# EAGLE design antenna_test_1 (EAGLE 6.5.0)
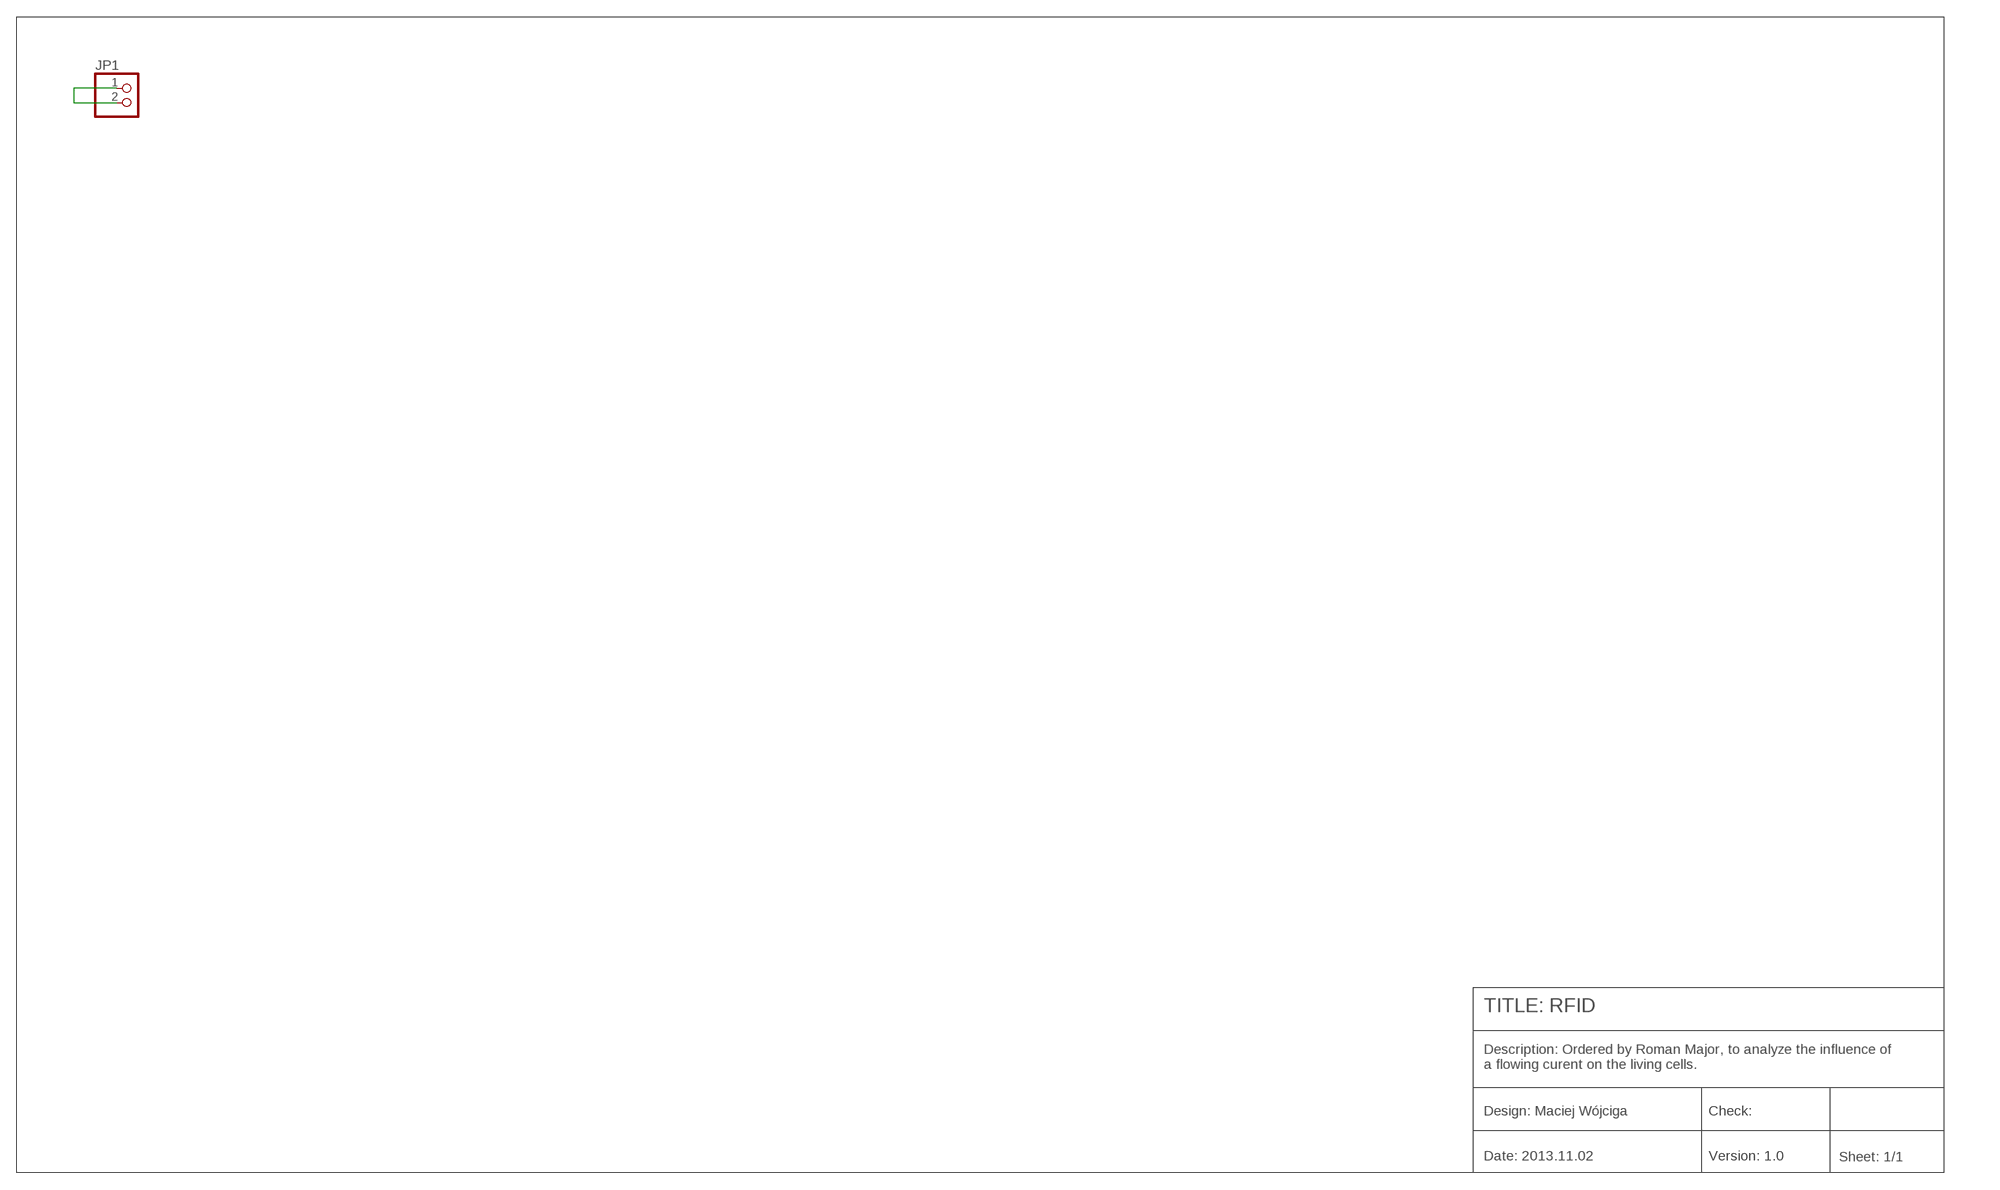
[diagram p0: schematic, sheet 1]

## Parts
JP1  PINHD-1X2  [1X02]

## Nets
N$1: JP1.1 JP1.2

## Notes on the sheet
- TITLE: RFID
- Description: Ordered by Roman Major, to analyze the influence of
  a flowing curent on the living cells.
- Design: Maciej Wójciga | Check:
- Date: 2013.11.02 | Version: 1.0 | Sheet: 1/1

## Library data of the parts
JP1 = pinhead:PINHD-1X2: PIN HEADER

## Board
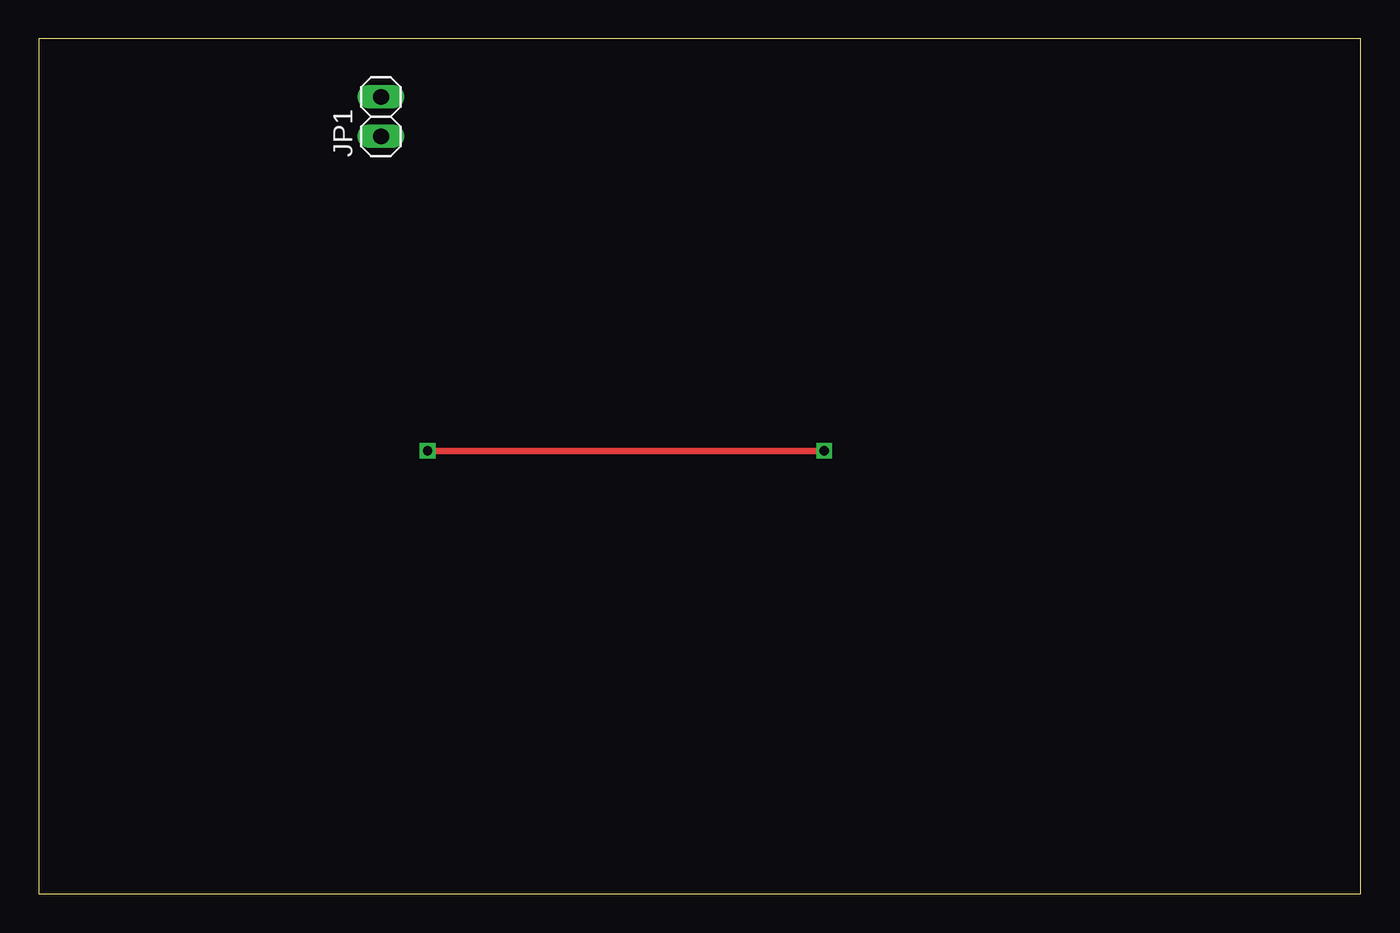
[diagram p1: board, top side]
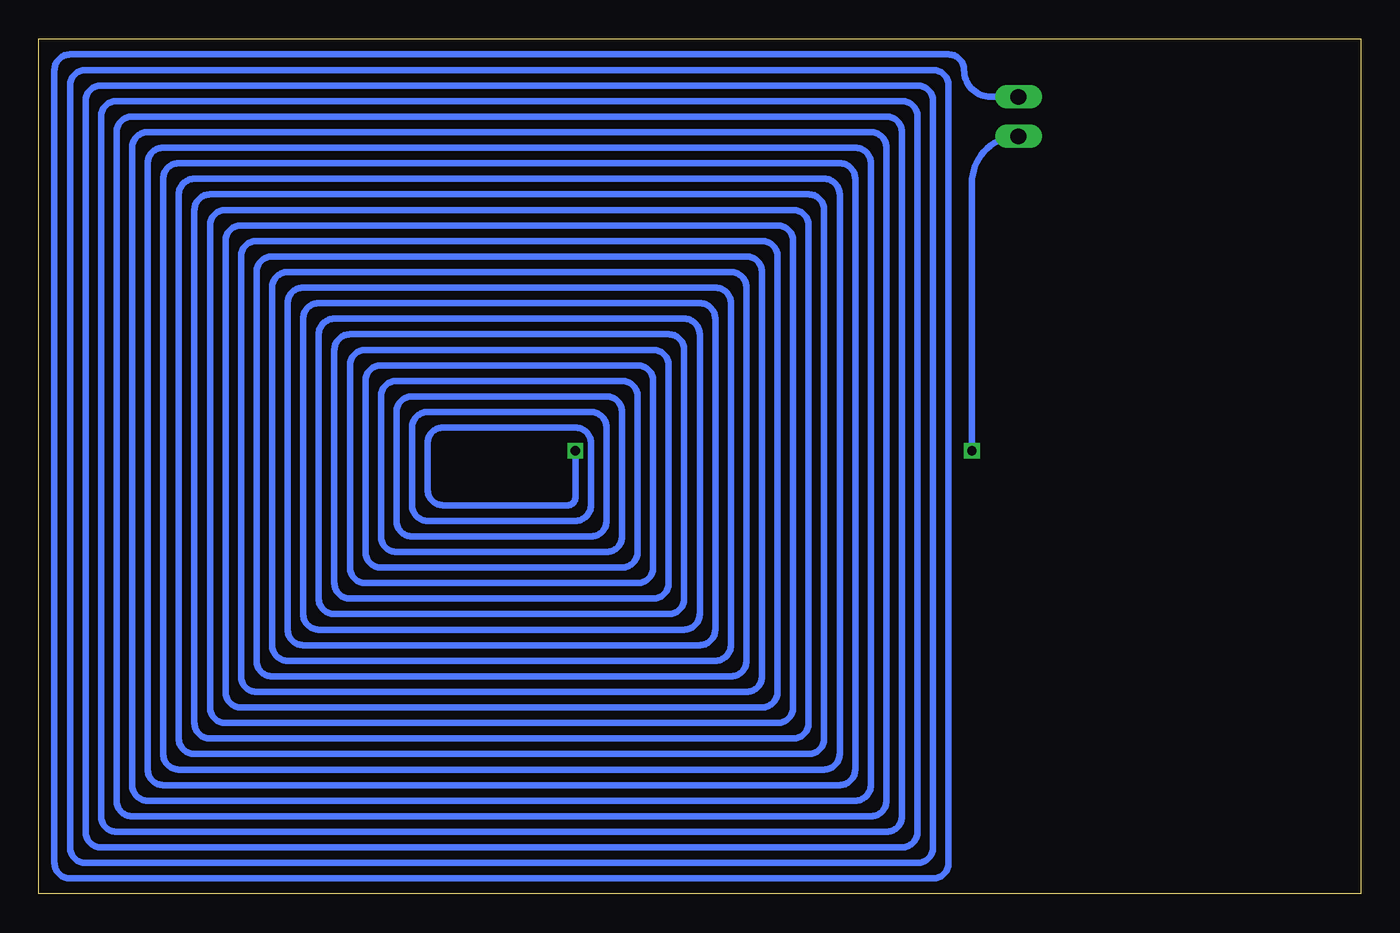
[diagram p2: board, bottom side, seen from below]

Size 85 x 55 mm. Coordinates in mm from the lower left corner, seen from the top.
Outline: 0,0 85,0 85,55 0,55 0,0
Copper layers (1*16): Top 0.035mm / dielectric 1.5mm / Bottom 0.035mm
Design rules "default": minimum track width 10mil, minimum drill 24mil, track to track 8mil, track to pad 8mil, pad to pad 8mil, via to via 8mil, smd to smd 8mil, copper to edge 40mil, drill to drill 8mil, minimum pad ring 10mil, minimum via ring 8mil, stop-mask expansion 4mil, vias tented up to drill 0mil, thermal gap 10mil

### Footprints (pad centres in the part's own frame; a part is rotated, then mirrored left to right if it is on the bottom)
1X02 = drill 1.016 long: 1 -1.27,0; 2 1.27,0

### Placement (x,y rotation side)
JP1  22,50 90 top

### Tracks (layer width: path | path; a pad name or v marks a point on that pad's centre or on a via)
N$1  (via drill 0.6)
  Top 0.406: v50.5,28.5 v25,28.5
  Bottom 0.406: JP1.2 23.77,51.27 arc90 25.5,53 arc-90 26.5,54 83,54 arc-90 84,53 84,2 arc-90 83,1 27.5,1 arc-90 26.5,2 26.5,52 arc-90 27.5,53 82,53 arc-90 83,52 83,3 arc-90 82,2 28.5,2 arc-90 27.5,3 27.5,51 arc-90 28.5,52 81,52 arc-90 82,51 82,4 arc-90 81,3 29.5,3 arc-90 28.5,4 28.5,50 arc-90 29.5,51 80,51 arc-90 81,50 81,5 arc-90 80,4 30.5,4 arc-90 29.5,5 29.5,49 arc-90 30.5,50 79,50 arc-90 80,49 80,6 arc-90 79,5 31.5,5 arc-90 30.5,6 30.5,48 arc-90 31.5,49 78,49 arc-90 79,48 79,7 arc-90 78,6 32.5,6 arc-90 31.5,7 31.5,47 arc-90 32.5,48 77,48 arc-90 78,47 78,8 arc-90 77,7 33.5,7 arc-90 32.5,8 32.5,46 arc-90 33.5,47 76,47 arc-90 77,46 77,9 arc-90 76,8 34.5,8 arc-90 33.5,9 33.5,45 arc-90 34.5,46 75,46 arc-90 76,45 76,10 arc-90 75,9 35.5,9 arc-90 34.5,10 34.5,44 arc-90 35.5,45 74,45 arc-90 75,44 75,11 arc-90 74,10 36.5,10 arc-90 35.5,11 35.5,43 arc-90 36.5,44 73,44 arc-90 74,43 74,12 arc-90 73,11 37.5,11 arc-90 36.5,12 36.5,42 arc-90 37.5,43 72,43 arc-90 73,42 73,13 arc-90 72,12 38.5,12 arc-90 37.5,13 37.5,41 arc-90 38.5,42 71,42 arc-90 72,41 72,14 arc-90 71,13 39.5,13 arc-90 38.5,14 38.5,40 arc-90 39.5,41 70,41 arc-90 71,40 71,15 arc-90 70,14 40.5,14 arc-90 39.5,15 39.5,39 arc-90 40.5,40 69,40 arc-90 70,39 70,16 arc-90 69,15 41.5,15 arc-90 40.5,16 40.5,38 arc-90 41.5,39 68,39 arc-90 69,38 69,17 arc-90 68,16 42.5,16 arc-90 41.5,17 41.5,37 arc-90 42.5,38 67,38 arc-90 68,37 68,18 arc-90 67,17 43.5,17 arc-90 42.5,18 42.5,36 arc-90 43.5,37 66,37 arc-90 67,36 67,19 arc-90 66,18 44.5,18 arc-90 43.5,19 43.5,35 arc-90 44.5,36 65,36 arc-90 66,35 66,20 arc-90 65,19 45.5,19 arc-90 44.5,20 44.5,34 arc-90 45.5,35 64,35 arc-90 65,34 65,21 arc-90 64,20 46.5,20 arc-90 45.5,21 45.5,33 arc-90 46.5,34 63,34 arc-90 64,33 64,22 arc-90 63,21 47.5,21 arc-90 46.5,22 46.5,32 arc-90 47.5,33 62,33 arc-90 63,32 63,23 arc-90 62,22 48.5,22 arc-90 47.5,23 47.5,31 arc-90 48.5,32 61,32 arc-90 62,31 62,24 arc-90 61,23 49.5,23 arc-90 48.5,24 48.5,30 arc-90 49.5,31 60,31 arc-90 61,30 61,25 arc-90 60,24 50.5,24 arc-90 49.5,25 49.5,29 arc-90 50.5,30 59,30 arc-90 60,29 60,26 arc-90 59,25 51,25 arc-90 50.5,25.5 v50.5,28.5
  Bottom 0.406: v25,28.5 25,45.73 arc90 JP1.1